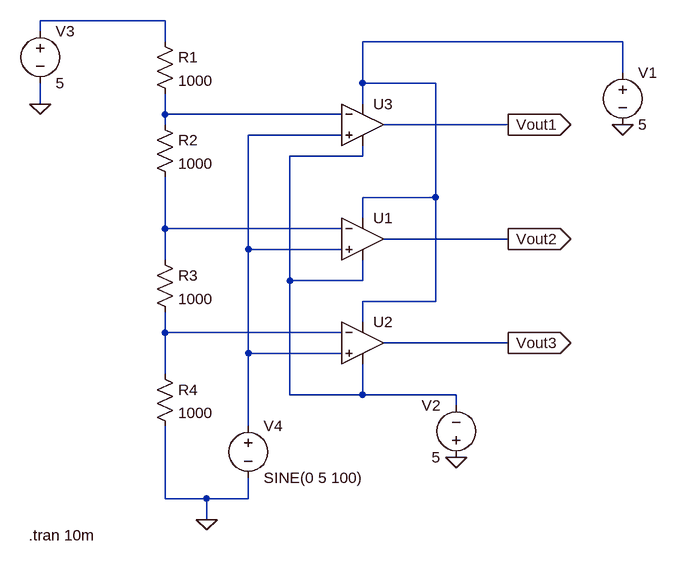
[diagram p0: schematic Flash_ADC.asc]
Flash_ADC.asc, the LTspice schematic file:
Version 4
SHEET 1 880 680
WIRE -16 -304 -208 -304
WIRE -208 -288 -208 -304
WIRE -16 -272 -16 -304
WIRE 688 -272 288 -272
WIRE 688 -224 688 -272
WIRE 288 -208 288 -272
WIRE 400 -208 288 -208
WIRE -208 -176 -208 -208
WIRE 288 -176 288 -208
WIRE -16 -160 -16 -192
WIRE 256 -160 -16 -160
WIRE -16 -144 -16 -160
WIRE 512 -144 320 -144
WIRE 256 -128 112 -128
WIRE 288 -96 288 -112
WIRE 288 -96 176 -96
WIRE 400 -32 400 -208
WIRE 400 -32 288 -32
WIRE 288 0 288 -32
WIRE -16 16 -16 -64
WIRE 256 16 -16 16
WIRE 512 32 320 32
WIRE 112 48 112 -128
WIRE 256 48 112 48
WIRE -16 64 -16 16
WIRE 176 96 176 -96
WIRE 288 96 288 64
WIRE 288 96 176 96
WIRE 400 128 400 -32
WIRE 400 128 288 128
WIRE 288 160 288 128
WIRE -16 176 -16 144
WIRE 256 176 -16 176
WIRE 512 192 320 192
WIRE 112 208 112 48
WIRE 256 208 112 208
WIRE -16 240 -16 176
WIRE 176 272 176 96
WIRE 288 272 288 224
WIRE 288 272 176 272
WIRE 432 272 288 272
WIRE 432 288 432 272
WIRE 112 320 112 208
WIRE -16 432 -16 320
WIRE 48 432 -16 432
WIRE 112 432 112 400
WIRE 112 432 48 432
WIRE 48 464 48 432
FLAG 432 368 0
FLAG 688 -144 0
FLAG 48 464 0
FLAG -208 -176 0
FLAG 512 -144 Vout1
IOPIN 512 -144 Out
FLAG 512 32 Vout2
IOPIN 512 32 Out
FLAG 512 192 Vout3
IOPIN 512 192 Out
SYMBOL OpAmps\\UniversalOpamp2 288 32 R0
SYMATTR InstName U1
SYMBOL OpAmps\\UniversalOpamp2 288 192 R0
SYMATTR InstName U2
SYMBOL OpAmps\\UniversalOpamp2 288 -144 R0
SYMATTR InstName U3
SYMBOL voltage 688 -240 R0
WINDOW 123 0 0 Left 0
WINDOW 39 0 0 Left 0
SYMATTR InstName V1
SYMATTR Value 5
SYMBOL voltage 432 384 R180
WINDOW 0 24 96 Left 2
WINDOW 3 24 16 Left 2
WINDOW 123 0 0 Left 0
WINDOW 39 0 0 Left 0
SYMATTR InstName V2
SYMATTR Value 5
SYMBOL voltage -208 -304 R0
WINDOW 123 0 0 Left 0
WINDOW 39 0 0 Left 0
SYMATTR InstName V3
SYMATTR Value 5
SYMBOL res -32 -288 R0
SYMATTR InstName R1
SYMATTR Value 1000
SYMBOL res -32 -160 R0
SYMATTR InstName R2
SYMATTR Value 1000
SYMBOL res -32 48 R0
SYMATTR InstName R3
SYMATTR Value 1000
SYMBOL res -32 224 R0
SYMATTR InstName R4
SYMATTR Value 1000
SYMBOL voltage 112 304 R0
WINDOW 123 0 0 Left 0
WINDOW 39 0 0 Left 0
SYMATTR InstName V4
SYMATTR Value SINE(0 5 100)
TEXT -226 488 Left 2 !.tran 10m

The netlist it stands for:
* Flash_ADC.asc
XU1 N004 N006 N002 N005 Vout2 level.2 Avol=1Meg GBW=10Meg Slew=10Meg ilimit=25m rail=0 Vos=0 phimargin=45 en=0 enk=0 in=0 ink=0 Rin=500Meg  ; pins IN+ IN- V+ V- OUT
XU2 N004 N007 N002 N005 Vout3 level.2 Avol=1Meg GBW=10Meg Slew=10Meg ilimit=25m rail=0 Vos=0 phimargin=45 en=0 enk=0 in=0 ink=0 Rin=500Meg  ; pins IN+ IN- V+ V- OUT
XU3 N004 N003 N002 N005 Vout1 level.2 Avol=1Meg GBW=10Meg Slew=10Meg ilimit=25m rail=0 Vos=0 phimargin=45 en=0 enk=0 in=0 ink=0 Rin=500Meg  ; pins IN+ IN- V+ V- OUT
V1 N002 0 5
V2 0 N005 5
V3 N001 0 5
R1 N001 N003 1000
R2 N003 N006 1000
R3 N006 N007 1000
R4 N007 0 1000
V4 N004 0 SINE(0 5 100)
.tran 10m
.lib UniversalOpamps2.sub
.backanno
.end